# Altium schematic sheet user_interface.SchDoc
size A4
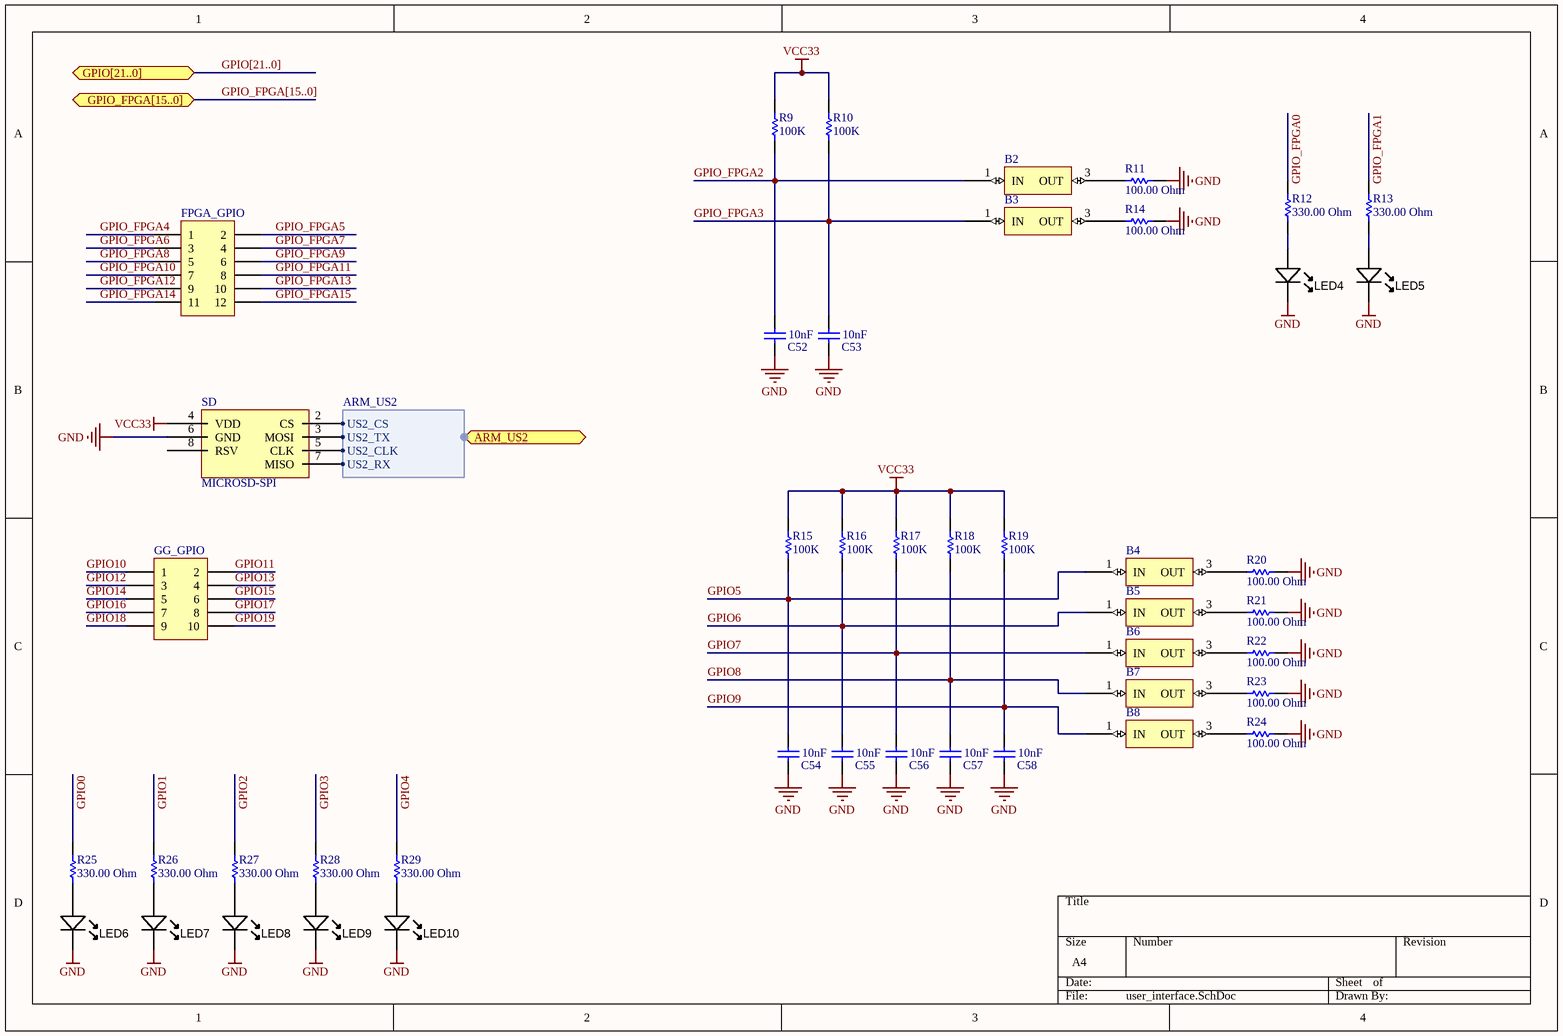
[diagram p0: user_interface.SchDoc]

## Parts
B2  BUTTON  [BUTTON]  (value not drawn)
B3  BUTTON  [BUTTON]  (value not drawn)
B4  BUTTON  [BUTTON]  (value not drawn)
B5  BUTTON  [BUTTON]  (value not drawn)
B6  BUTTON  [BUTTON]  (value not drawn)
B7  BUTTON  [BUTTON]  (value not drawn)
B8  BUTTON  [BUTTON]  (value not drawn)
C52  10nF  [CAPC0805(2012)75_N]
C53  10nF  [CAPC0805(2012)75_N]
C54  10nF  [CAPC0805(2012)75_N]
C55  10nF  [CAPC0805(2012)75_N]
C56  10nF  [CAPC0805(2012)75_N]
C57  10nF  [CAPC0805(2012)75_N]
C58  10nF  [CAPC0805(2012)75_N]
FPGA_GPIO  Header 6X2  [HDR2X6]  (value not drawn)
GG_GPIO  Header 5X2  [HDR2X5]  (value not drawn)
LED4  Green  [LED-0805-K]  (value not drawn)
LED5  Green  [LED-0805-K]  (value not drawn)
LED6  Green  [LED-0805-K]  (value not drawn)
LED7  Green  [LED-0805-K]  (value not drawn)
LED8  Green  [LED-0805-K]  (value not drawn)
LED9  Green  [LED-0805-K]  (value not drawn)
LED10  Green  [LED-0805-K]  (value not drawn)
R9  100K  [RESC0805(2012)_L]
R10  100K  [RESC0805(2012)_L]
R11  100.00 Ohm  [RESC0805(2012)_M]
R12  330.00 Ohm  [RESC0805(2012)_M]
R13  330.00 Ohm  [RESC0805(2012)_M]
R14  100.00 Ohm  [RESC0805(2012)_M]
R15  100K  [RESC0805(2012)_L]
R16  100K  [RESC0805(2012)_L]
R17  100K  [RESC0805(2012)_L]
R18  100K  [RESC0805(2012)_L]
R19  100K  [RESC0805(2012)_L]
R20  100.00 Ohm  [RESC0805(2012)_M]
R21  100.00 Ohm  [RESC0805(2012)_M]
R22  100.00 Ohm  [RESC0805(2012)_M]
R23  100.00 Ohm  [RESC0805(2012)_M]
R24  100.00 Ohm  [RESC0805(2012)_M]
R25  330.00 Ohm  [RESC0805(2012)_M]
R26  330.00 Ohm  [RESC0805(2012)_M]
R27  330.00 Ohm  [RESC0805(2012)_M]
R28  330.00 Ohm  [RESC0805(2012)_M]
R29  330.00 Ohm  [RESC0805(2012)_M]
SD  MICROSD-SPI  [MICROSD_WR-CRD]

## Ports
ARM_US2 (harness ARM_US2), GPIO[21..0] (bidir), GPIO_FPGA[15..0] (bidir)

## Harnesses
ARM_US2: US2_TX, US2_RX, US2_CLK, US2_CS

## Nets
GND: C52.1 C53.1 C54.1 C55.1 C56.1 C57.1 C58.1 LED4.K LED5.K LED6.K LED7.K LED8.K LED9.K LED10.K R11.2 R14.2 R20.2 R21.2 R22.2 R23.2 R24.2 SD.6(GND)
VCC33: R9.2 R10.2 R15.2 R16.2 R17.2 R18.2 R19.2 SD.4(VDD)
GPIO0: R25.2
GPIO1: R26.2
GPIO2: R27.2
GPIO3: R28.2
GPIO4: R29.2
GPIO5: B4.1(IN) C54.2 R15.1
GPIO6: B5.1(IN) C55.2 R16.1
GPIO7: B6.1(IN) C56.2 R17.1
GPIO8: B7.1(IN) C57.2 R18.1
GPIO9: B8.1(IN) C58.2 R19.1
GPIO10: GG_GPIO.1
GPIO11: GG_GPIO.2
GPIO12: GG_GPIO.3
GPIO13: GG_GPIO.4
GPIO14: GG_GPIO.5
GPIO15: GG_GPIO.6
GPIO16: GG_GPIO.7
GPIO17: GG_GPIO.8
GPIO18: GG_GPIO.9
GPIO19: GG_GPIO.10
GPIO_FPGA0: R12.2
GPIO_FPGA1: R13.2
GPIO_FPGA2: B2.1(IN) C52.2 R9.1
GPIO_FPGA3: B3.1(IN) C53.2 R10.1
GPIO_FPGA4: FPGA_GPIO.1
GPIO_FPGA5: FPGA_GPIO.2
GPIO_FPGA6: FPGA_GPIO.3
GPIO_FPGA7: FPGA_GPIO.4
GPIO_FPGA8: FPGA_GPIO.5
GPIO_FPGA9: FPGA_GPIO.6
GPIO_FPGA10: FPGA_GPIO.7
GPIO_FPGA11: FPGA_GPIO.8
GPIO_FPGA12: FPGA_GPIO.9
GPIO_FPGA13: FPGA_GPIO.10
GPIO_FPGA14: FPGA_GPIO.11
GPIO_FPGA15: FPGA_GPIO.12
NetB2_3: B2.3(OUT) R11.1
NetB3_3: B3.3(OUT) R14.1
NetB4_3: B4.3(OUT) R20.1
NetB5_3: B5.3(OUT) R21.1
NetB6_3: B6.3(OUT) R22.1
NetB7_3: B7.3(OUT) R23.1
NetB8_3: B8.3(OUT) R24.1
NetLED4_A: LED4.A R12.1
NetLED5_A: LED5.A R13.1
NetLED6_A: LED6.A R25.1
NetLED7_A: LED7.A R26.1
NetLED8_A: LED8.A R27.1
NetLED9_A: LED9.A R28.1
NetLED10_A: LED10.A R29.1
NetSD_2: SD.2(CS) ; port ARM_US2.US2_CS
NetSD_3: SD.3(MOSI) ; port ARM_US2.US2_TX
NetSD_5: SD.5(CLK) ; port ARM_US2.US2_CLK
NetSD_7: SD.7(MISO) ; port ARM_US2.US2_RX

Not connected (* = marked no-connect by the designer): SD 8(RSV)

## Buses and harness runs
bus GPIO[21..0] = port GPIO[21..0]
bus GPIO_FPGA[15..0] = port GPIO_FPGA[15..0]

## Library data of the parts
C52-C58 = CMP-1036-03842-1: CAP 10nF 50V ±10% 0805 (2012 Metric) Thickness 0.75mm SMD; Case-Metric: 2012; Case-EIA: 0805; Value: 10nF; Max Thickness: 0.75 mm; Rated Voltage: 50 V; Tolerance: ±10%; Technology: SMT
FPGA_GPIO = Header 6X2: Header, 6-Pin, Dual row; LatestRevisionDate: 17-Jul-2002; LatestRevisionNote: Re-released for DXP Platform.; Publisher: Altium Limited
GG_GPIO = Header 5X2: Header, 5-Pin, Dual row; LatestRevisionDate: 17-Jul-2002; LatestRevisionNote: Re-released for DXP Platform.; Publisher: Altium Limited
LED4-LED10 = LED_SMD_Green_0805: LED, 0805 SMD, Green; Manufacturer 1: Ligitek; Manufacturer Part Number 1: LG170G-CT; Material: GaP; Ratings: 10 mcd; 573 nm; Package / Case: 0805
R9 R10 R15-R19 = CMP-1013-00122-1: 100K 0.125W 5% 0805 (2012 Metric)  SMD; Case-Metric: 2012; Value: 100000.00 Ohm; Case-EIA: 0805; Tolerance: 5 %; Technology: SMT; Power: 0.125 W
R11 R14 R20-R24 = CMP-1013-00050-1: 100R 0.125W 5% 0805 (2012 Metric)  SMD; Case-EIA: 0805; Case-Metric: 2012; Tolerance: 5 %; Power: 0.125 W; Technology: SMT; Value: 100.00 Ohm
R12 R13 R25-R29 = CMP-1013-00454-1: 330R 0.125W 1% 0805 (2012 Metric)  SMD; Case-EIA: 0805; Case-Metric: 2012; Value: 330.00 Ohm; Power: 0.125 W; Tolerance: 1 %; Technology: SMT